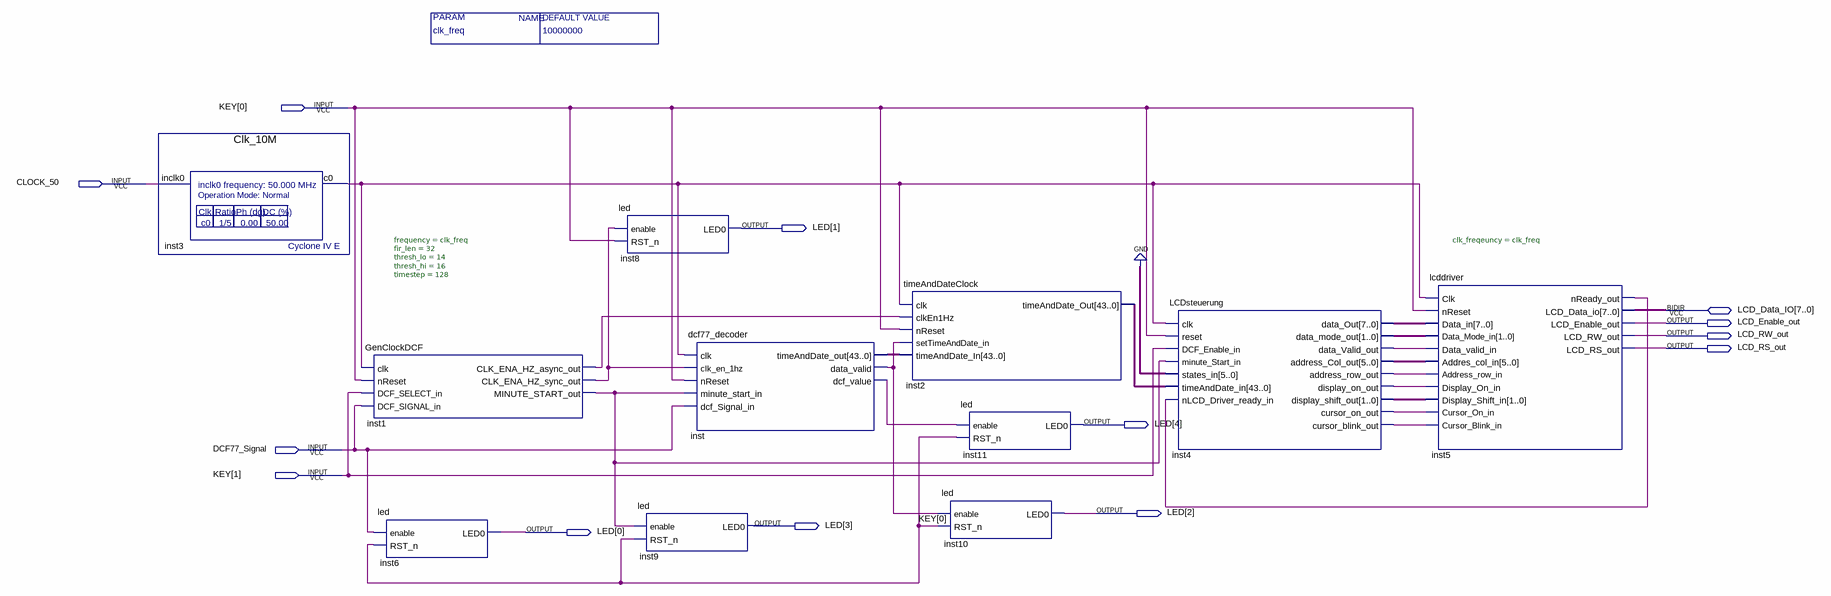
[diagram p0: schematic sheet]
// Quartus schematic DCF_decoder.bdf as structural Verilog: 11 symbols, 13 pins
module DCF_decoder #(parameter clk_freq = 10000000) (
  input  [1:0] KEY,
  input  CLOCK_50,
  input  DCF77_Signal,
  inout  [7:0] LCD_Data_IO,
  output [4:0] LED,
  output LCD_Enable_out,
  output LCD_RW_out,
  output LCD_RS_out
);

  wire inst1_clk_ena_hz_async_out, inst1_clk_ena_hz_sync_out, inst1_minute_start_out, inst3_c0,
       inst4_address_row_out, inst4_cursor_blink_out, inst4_cursor_on_out, inst4_data_valid_out,
       inst4_display_on_out, inst5_nready_out, inst_data_valid, inst_dcf_value;
  wire [1:0] inst4_data_mode_out, inst4_display_shift_out;
  wire [5:0] inst4_address_col_out;
  wire [7:0] inst4_data_out;
  wire [43:0] inst2_timeanddate_out, inst_timeanddate_out;

  Clk_10M inst3 (.inclk0(CLOCK_50), .c0(inst3_c0));
  GenClockDCF #(.frequency(clk_freq), .fir_len(32), .thresh_lo(14), .thresh_hi(16), .timestep(128)) inst1 (
    .clk(inst3_c0), .nReset(KEY[0]), .DCF_SELECT_in(KEY[1]), .DCF_SIGNAL_in(DCF77_Signal),
    .CLK_ENA_HZ_async_out(inst1_clk_ena_hz_async_out), .CLK_ENA_HZ_sync_out(inst1_clk_ena_hz_sync_out),
    .MINUTE_START_out(inst1_minute_start_out));
  led inst6 (.enable(DCF77_Signal), .RST_n(KEY[0]), .LED0(LED[0]));
  led inst8 (.enable(inst1_clk_ena_hz_sync_out), .RST_n(KEY[0]), .LED0(LED[1]));
  led inst9 (.enable(inst1_minute_start_out), .RST_n(KEY[0]));  // open: LED0
  dcf77_decoder inst (
    .clk(inst3_c0), .clk_en_1hz(inst1_clk_ena_hz_sync_out), .nReset(KEY[0]),
    .minute_start_in(inst1_minute_start_out), .dcf_Signal_in(DCF77_Signal),
    .timeAndDate_out(inst_timeanddate_out), .data_valid(inst_data_valid), .dcf_value(inst_dcf_value));
  timeAndDateClock inst2 (
    .clk(inst3_c0), .clkEn1Hz(inst1_clk_ena_hz_async_out), .nReset(KEY[0]),
    .setTimeAndDate_in(inst_data_valid), .timeAndDate_In(inst_timeanddate_out),
    .timeAndDate_Out(inst2_timeanddate_out));
  led inst11 (.enable(inst_dcf_value), .RST_n(KEY[0]), .LED0(LED[4]));
  led inst10 (.enable(inst_data_valid), .RST_n(KEY[0]), .LED0(LED[2]));
  LCDsteuerung inst4 (
    .clk(inst3_c0), .reset(KEY[0]), .DCF_Enable_in(KEY[1]), .minute_Start_in(inst1_minute_start_out),
    .states_in({6{1'b0}}), .timeAndDate_in(inst2_timeanddate_out), .nLCD_Driver_ready_in(inst5_nready_out),
    .data_Out(inst4_data_out), .data_mode_out(inst4_data_mode_out), .data_Valid_out(inst4_data_valid_out),
    .address_Col_out(inst4_address_col_out), .address_row_out(inst4_address_row_out),
    .display_on_out(inst4_display_on_out), .display_shift_out(inst4_display_shift_out),
    .cursor_on_out(inst4_cursor_on_out), .cursor_blink_out(inst4_cursor_blink_out));
  lcddriver #(.clk_freqeuncy(clk_freq)) inst5 (
    .Clk(inst3_c0), .nReset(KEY[0]), .Data_in(inst4_data_out), .Data_Mode_in(inst4_data_mode_out),
    .Data_valid_in(inst4_data_valid_out), .Addres_col_in(inst4_address_col_out),
    .Address_row_in(inst4_address_row_out), .Display_On_in(inst4_display_on_out),
    .Display_Shift_in(inst4_display_shift_out), .Cursor_On_in(inst4_cursor_on_out),
    .Cursor_Blink_in(inst4_cursor_blink_out), .nReady_out(inst5_nready_out), .LCD_Enable_out(LCD_Enable_out),
    .LCD_RW_out(LCD_RW_out), .LCD_RS_out(LCD_RS_out), .LCD_Data_io(LCD_Data_IO));
endmodule
